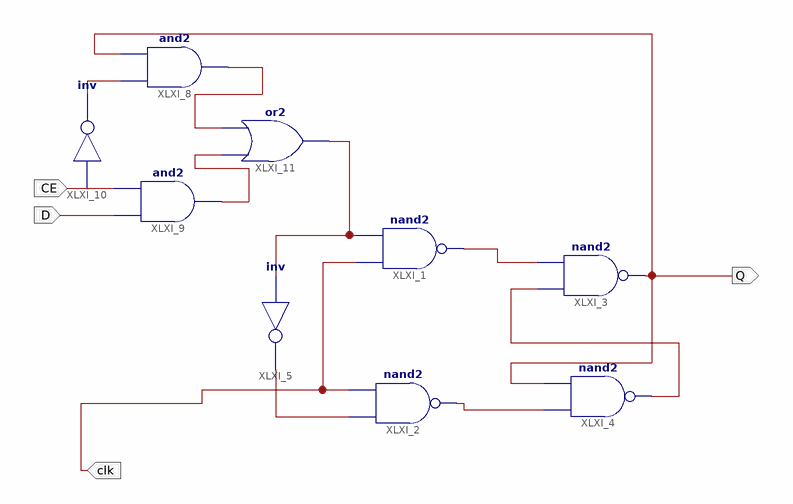
[diagram p0: schematic sheet 1]
// Xilinx ISE schematic DFF.sch (artix7) as structural Verilog: 9 symbols, 4 ports
module DFF (
  input  clk,
  input  CE,
  input  D,
  output Q
);

  wire XLXN_2, XLXN_4, XLXN_6, XLXN_8, XLXN_21, XLXN_22, XLXN_23, XLXN_24;

  nand XLXI_1 (XLXN_2, clk, XLXN_24);
  nand XLXI_2 (XLXN_4, XLXN_8, clk);
  nand XLXI_3 (Q, XLXN_6, XLXN_2);
  nand XLXI_4 (XLXN_6, XLXN_4, Q);
  not XLXI_5 (XLXN_8, XLXN_24);
  and XLXI_8 (XLXN_22, XLXN_21, Q);
  and XLXI_9 (XLXN_23, D, CE);
  not XLXI_10 (XLXN_21, CE);
  or XLXI_11 (XLXN_24, XLXN_23, XLXN_22);
endmodule
